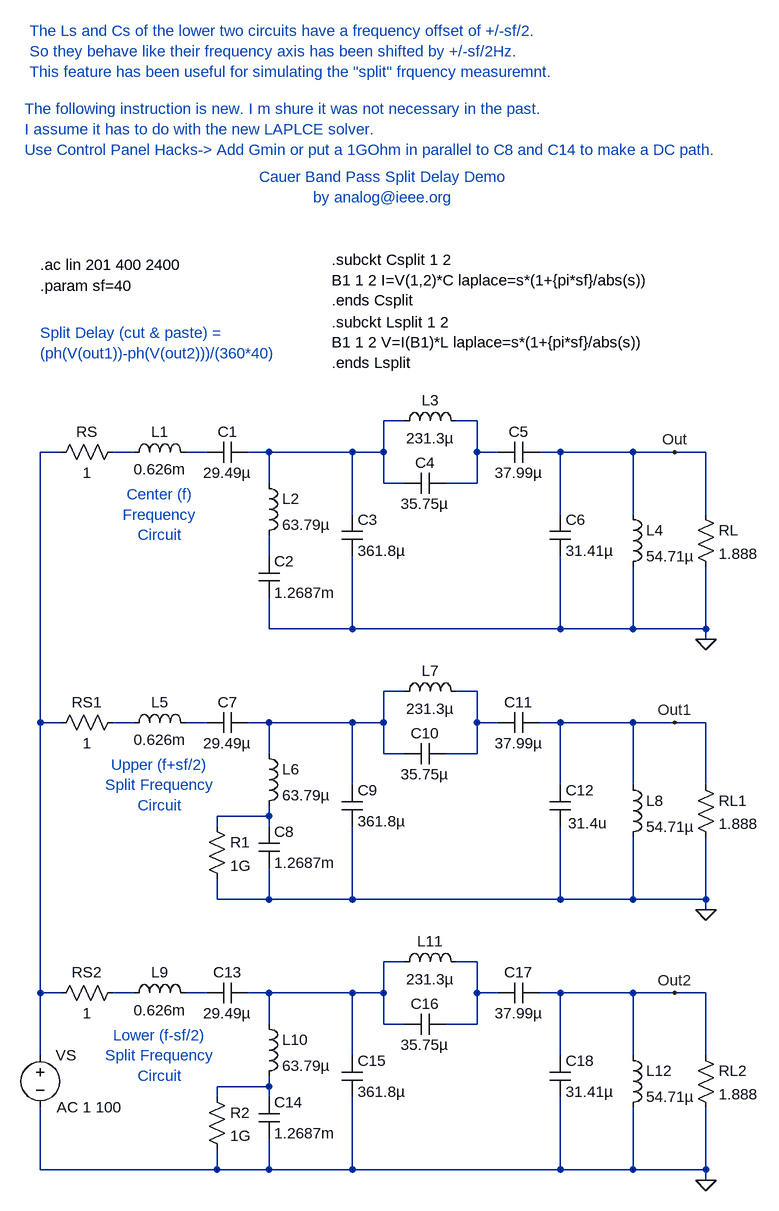
[diagram p0: schematic split_freq_filter.asc]
split_freq_filter.asc, the LTspice schematic file:
Version 4
SHEET 1 1868 1332
WIRE 80 128 48 128
WIRE 48 128 48 544
WIRE 160 128 192 128
WIRE 272 128 304 128
WIRE 400 128 400 176
WIRE 528 128 528 224
WIRE 576 176 608 176
WIRE 576 176 576 128
WIRE 576 80 608 80
WIRE 672 176 720 176
WIRE 720 176 720 128
WIRE 720 80 688 80
WIRE 528 288 528 400
WIRE 400 352 400 400
WIRE 400 256 400 288
WIRE 368 128 400 128
WIRE 400 128 528 128
WIRE 576 128 576 80
WIRE 720 128 752 128
WIRE 720 128 720 80
WIRE 816 128 848 128
WIRE 848 128 960 128
WIRE 848 224 848 128
WIRE 1072 128 1072 224
WIRE 960 224 960 128
WIRE 848 288 848 400
WIRE 1072 400 1072 304
WIRE 960 304 960 400
WIRE 848 400 528 400
WIRE 1072 416 1072 400
WIRE 528 128 576 128
WIRE 528 400 400 400
WIRE 960 128 1024 128
WIRE 960 400 848 400
WIRE 960 400 1072 400
WIRE 1024 128 1072 128
WIRE 80 544 48 544
WIRE 160 544 192 544
WIRE 272 544 304 544
WIRE 400 544 400 592
WIRE 528 544 528 640
WIRE 576 592 608 592
WIRE 576 592 576 544
WIRE 576 496 608 496
WIRE 672 592 720 592
WIRE 720 592 720 544
WIRE 720 496 688 496
WIRE 528 704 528 816
WIRE 400 768 400 816
WIRE 400 672 400 688
WIRE 368 544 400 544
WIRE 400 544 528 544
WIRE 576 544 576 496
WIRE 720 544 752 544
WIRE 720 544 720 496
WIRE 816 544 848 544
WIRE 848 544 960 544
WIRE 848 640 848 544
WIRE 1072 544 1072 640
WIRE 960 640 960 544
WIRE 848 704 848 816
WIRE 1072 816 1072 720
WIRE 960 720 960 816
WIRE 848 816 528 816
WIRE 528 544 576 544
WIRE 528 816 400 816
WIRE 960 544 1024 544
WIRE 960 816 848 816
WIRE 960 816 1072 816
WIRE 1024 544 1072 544
WIRE 1072 832 1072 816
WIRE 80 960 48 960
WIRE 160 960 192 960
WIRE 272 960 304 960
WIRE 400 960 400 1008
WIRE 528 960 528 1056
WIRE 576 1008 608 1008
WIRE 576 1008 576 960
WIRE 576 912 608 912
WIRE 672 1008 720 1008
WIRE 720 1008 720 960
WIRE 720 912 688 912
WIRE 528 1120 528 1232
WIRE 400 1184 400 1232
WIRE 400 1088 400 1104
WIRE 368 960 400 960
WIRE 400 960 528 960
WIRE 576 960 576 912
WIRE 720 960 752 960
WIRE 720 960 720 912
WIRE 816 960 848 960
WIRE 848 960 960 960
WIRE 848 1056 848 960
WIRE 1072 960 1072 1056
WIRE 960 1056 960 960
WIRE 848 1120 848 1232
WIRE 1072 1232 1072 1136
WIRE 960 1136 960 1232
WIRE 848 1232 528 1232
WIRE 528 960 576 960
WIRE 528 1232 400 1232
WIRE 960 960 1024 960
WIRE 960 1232 848 1232
WIRE 960 1232 1072 1232
WIRE 1024 960 1072 960
WIRE 1072 1248 1072 1232
WIRE 48 960 48 544
WIRE 48 960 48 1056
WIRE 48 1136 48 1232
WIRE 48 1232 320 1232
WIRE 400 1104 320 1104
WIRE 400 1104 400 1120
WIRE 320 1104 320 1120
WIRE 320 1200 320 1232
WIRE 320 1232 400 1232
WIRE 320 704 320 688
WIRE 320 784 320 816
WIRE 320 816 400 816
WIRE 320 688 400 688
WIRE 400 688 400 704
FLAG 1024 128 Out
FLAG 1072 416 0
FLAG 1024 544 Out1
FLAG 1072 832 0
FLAG 1024 960 Out2
FLAG 1072 1248 0
SYMBOL voltage 48 1040 R0
WINDOW 123 25 96 Left 0
WINDOW 39 -32 56 VBottom 0
SYMATTR Value2 AC 1 100
SYMATTR InstName VS
SYMATTR Value ""
SYMBOL res 64 144 R270
WINDOW 0 32 56 VTop 0
WINDOW 3 0 56 VBottom 0
SYMATTR InstName RS
SYMATTR Value 1
SYMBOL ind 176 144 R270
WINDOW 0 32 56 VTop 0
WINDOW 3 5 56 VBottom 0
SYMATTR InstName L1
SYMATTR Value 0.626m
SYMATTR SpiceLine Rser=0
SYMBOL cap 304 144 R270
WINDOW 0 32 32 VTop 0
WINDOW 3 0 32 VBottom 0
SYMATTR InstName C1
SYMATTR Value 29.49µ
SYMBOL ind 384 160 R0
SYMATTR InstName L2
SYMATTR Value 63.79µ
SYMATTR SpiceLine Rser=0
SYMBOL cap 384 288 R0
SYMATTR InstName C2
SYMATTR Value 1.2687m
SYMBOL cap 512 224 R0
SYMATTR InstName C3
SYMATTR Value 361.8µ
SYMBOL cap 608 192 R270
WINDOW 0 32 32 VTop 0
WINDOW 3 0 32 VBottom 0
SYMATTR InstName C4
SYMATTR Value 35.75µ
SYMBOL ind 592 96 R270
WINDOW 0 32 56 VTop 0
WINDOW 3 5 56 VBottom 0
SYMATTR InstName L3
SYMATTR Value 231.3µ
SYMATTR SpiceLine Rser=0
SYMBOL cap 752 144 R270
WINDOW 0 32 32 VTop 0
WINDOW 3 0 32 VBottom 0
SYMATTR InstName C5
SYMATTR Value 37.99µ
SYMBOL cap 832 224 R0
SYMATTR InstName C6
SYMATTR Value 31.41µ
SYMBOL ind 944 208 R0
SYMATTR InstName L4
SYMATTR Value 54.71µ
SYMATTR SpiceLine Rser=0
SYMBOL res 1056 208 R0
SYMATTR InstName RL
SYMATTR Value 1.888
SYMBOL res 64 560 R270
WINDOW 0 32 56 VTop 0
WINDOW 3 0 56 VBottom 0
SYMATTR InstName RS1
SYMATTR Value 1
SYMBOL ind 176 560 R270
WINDOW 0 32 56 VTop 0
WINDOW 3 5 56 VBottom 0
SYMATTR InstName L5
SYMATTR Value 0.626m
SYMATTR Prefix X
SYMATTR SpiceModel Lsplit L=
SYMBOL cap 304 560 R270
WINDOW 0 32 32 VTop 0
WINDOW 3 0 32 VBottom 0
SYMATTR InstName C7
SYMATTR Value 29.49µ
SYMATTR Prefix X
SYMATTR SpiceModel Csplit C=
SYMBOL ind 384 576 R0
SYMATTR InstName L6
SYMATTR Value 63.79µ
SYMATTR Prefix X
SYMATTR SpiceModel Lsplit L=
SYMBOL cap 384 704 R0
SYMATTR InstName C8
SYMATTR Value 1.2687m
SYMATTR Prefix X
SYMATTR SpiceModel Csplit C=
SYMBOL cap 512 640 R0
SYMATTR InstName C9
SYMATTR Value 361.8µ
SYMATTR Prefix X
SYMATTR SpiceModel Csplit C=
SYMBOL cap 608 608 R270
WINDOW 0 32 32 VTop 0
WINDOW 3 0 32 VBottom 0
SYMATTR InstName C10
SYMATTR Value 35.75µ
SYMATTR Prefix X
SYMATTR SpiceModel Csplit C=
SYMBOL ind 592 512 R270
WINDOW 0 32 56 VTop 0
WINDOW 3 5 56 VBottom 0
SYMATTR InstName L7
SYMATTR Value 231.3µ
SYMATTR Prefix X
SYMATTR SpiceModel Lsplit L=
SYMBOL cap 752 560 R270
WINDOW 0 32 32 VTop 0
WINDOW 3 0 32 VBottom 0
SYMATTR InstName C11
SYMATTR Value 37.99µ
SYMATTR Prefix X
SYMATTR SpiceModel Csplit C=
SYMBOL cap 832 640 R0
WINDOW 3 28 59 Left 0
SYMATTR Value 31.4u
SYMATTR InstName C12
SYMATTR Prefix X
SYMATTR SpiceModel Csplit C=
SYMBOL ind 944 624 R0
SYMATTR InstName L8
SYMATTR Value 54.71µ
SYMATTR Prefix X
SYMATTR SpiceModel Lsplit L=
SYMBOL res 1056 624 R0
SYMATTR InstName RL1
SYMATTR Value 1.888
SYMBOL res 64 976 R270
WINDOW 0 32 56 VTop 0
WINDOW 3 0 56 VBottom 0
SYMATTR InstName RS2
SYMATTR Value 1
SYMBOL ind 176 976 R270
WINDOW 0 32 56 VTop 0
WINDOW 3 5 56 VBottom 0
SYMATTR InstName L9
SYMATTR Value 0.626m
SYMATTR Prefix X
SYMATTR SpiceModel Lsplit L=
SYMATTR Value2 sf={-sf}
SYMBOL cap 304 976 R270
WINDOW 0 32 32 VTop 0
WINDOW 3 0 32 VBottom 0
SYMATTR InstName C13
SYMATTR Value 29.49µ
SYMATTR Prefix X
SYMATTR SpiceModel Csplit C=
SYMATTR Value2 sf={-sf}
SYMBOL ind 384 992 R0
SYMATTR InstName L10
SYMATTR Value 63.79µ
SYMATTR Prefix X
SYMATTR SpiceModel Lsplit L=
SYMATTR Value2 sf={-sf}
SYMBOL cap 384 1120 R0
SYMATTR InstName C14
SYMATTR Value 1.2687m
SYMATTR Prefix X
SYMATTR SpiceModel Csplit C=
SYMATTR Value2 sf={-sf}
SYMBOL cap 512 1056 R0
SYMATTR InstName C15
SYMATTR Value 361.8µ
SYMATTR Prefix X
SYMATTR SpiceModel Csplit C=
SYMATTR Value2 sf={-sf}
SYMBOL cap 608 1024 R270
WINDOW 0 32 32 VTop 0
WINDOW 3 0 32 VBottom 0
SYMATTR InstName C16
SYMATTR Value 35.75µ
SYMATTR Prefix X
SYMATTR SpiceModel Csplit C=
SYMATTR Value2 sf={-sf}
SYMBOL ind 592 928 R270
WINDOW 0 32 56 VTop 0
WINDOW 3 5 56 VBottom 0
SYMATTR InstName L11
SYMATTR Value 231.3µ
SYMATTR Prefix X
SYMATTR SpiceModel Lsplit L=
SYMATTR Value2 sf={-sf}
SYMBOL cap 752 976 R270
WINDOW 0 32 32 VTop 0
WINDOW 3 0 32 VBottom 0
SYMATTR InstName C17
SYMATTR Value 37.99µ
SYMATTR Prefix X
SYMATTR SpiceModel Csplit C=
SYMATTR Value2 sf={-sf}
SYMBOL cap 832 1056 R0
SYMATTR InstName C18
SYMATTR Value 31.41µ
SYMATTR Prefix X
SYMATTR SpiceModel Csplit C=
SYMATTR Value2 sf={-sf}
SYMBOL ind 944 1040 R0
SYMATTR InstName L12
SYMATTR Value 54.71µ
SYMATTR Prefix X
SYMATTR SpiceModel Lsplit L=
SYMATTR Value2 sf={-sf}
SYMBOL res 1056 1040 R0
SYMATTR InstName RL2
SYMATTR Value 1.888
SYMBOL res 304 688 R0
SYMATTR InstName R1
SYMATTR Value 1G
SYMBOL res 304 1104 R0
SYMATTR InstName R2
SYMATTR Value 1G
TEXT 48 -160 Left 0 !.ac lin 201 400 2400
TEXT 576 -280 Center 0 ;Cauer Band Pass Split Delay Demo\nby analog@ieee.org
TEXT 496 -168 Left 0 !.subckt Csplit 1 2\nB1 1 2 I=V(1,2)*C laplace=s*(1+{pi*sf}/abs(s))\n.ends Csplit
TEXT 48 -56 Left 0 ;Split Delay (cut & paste) =
TEXT 496 -72 Left 0 !.subckt Lsplit 1 2\nB1 1 2 V=I(B1)*L laplace=s*(1+{pi*sf}/abs(s))\n.ends Lsplit
TEXT 48 -128 Left 0 !.param sf=40
TEXT 232 640 Center 0 ;Upper (f+sf/2)\nSplit Frequency\nCircuit
TEXT 232 1056 Center 0 ;Lower (f-sf/2)\nSplit Frequency\nCircuit
TEXT 48 -24 Left 0 ;(ph(V(out1))-ph(V(out2)))/(360*40)
TEXT 232 224 Center 0 ;Center (f)\nFrequency\nCircuit
TEXT 24 -400 Left 0 ;The following instruction is new. I m shure it was not necessary in the past.\nI assume it has to do with the new LAPLCE solver.\nUse Control Panel Hacks-> Add Gmin or put a 1GOhm in parallel to C8 and C14 to make a DC path.
TEXT 32 -520 Left 0 ;The Ls and Cs of the lower two circuits have a frequency offset of +/-sf/2.\nSo they behave like their frequency axis has been shifted by +/-sf/2Hz.\nThis feature has been useful for simulating the "split" frquency measuremnt.

The netlist it stands for:
* split_freq_filter.asc
VS N001 0 AC 1 100
RS N001 N002 1
L1 N002 N003 0.626m Rser=0
C1 N003 N004 29.49µ
L2 N004 N006 63.79µ Rser=0
C2 N006 0 1.2687m
C3 N004 0 361.8µ
C4 N004 N005 35.75µ
L3 N004 N005 231.3µ Rser=0
C5 N005 Out 37.99µ
C6 Out 0 31.41µ
L4 Out 0 54.71µ Rser=0
RL Out 0 1.888
RS1 N001 N007 1
XL5 N007 N008 Lsplit L= 0.626m  ; pins A B
XC7 N008 N009 Csplit C= 29.49µ  ; pins A B
XL6 N009 N011 Lsplit L= 63.79µ  ; pins A B
XC8 N011 0 Csplit C= 1.2687m  ; pins A B
XC9 N009 0 Csplit C= 361.8µ  ; pins A B
XC10 N009 N010 Csplit C= 35.75µ  ; pins A B
XL7 N009 N010 Lsplit L= 231.3µ  ; pins A B
XC11 N010 Out1 Csplit C= 37.99µ  ; pins A B
XC12 Out1 0 Csplit C= 31.4u  ; pins A B
XL8 Out1 0 Lsplit L= 54.71µ  ; pins A B
RL1 Out1 0 1.888
RS2 N001 N012 1
XL9 N012 N013 Lsplit L= 0.626m sf={-sf}  ; pins A B
XC13 N013 N014 Csplit C= 29.49µ sf={-sf}  ; pins A B
XL10 N014 N016 Lsplit L= 63.79µ sf={-sf}  ; pins A B
XC14 N016 0 Csplit C= 1.2687m sf={-sf}  ; pins A B
XC15 N014 0 Csplit C= 361.8µ sf={-sf}  ; pins A B
XC16 N014 N015 Csplit C= 35.75µ sf={-sf}  ; pins A B
XL11 N014 N015 Lsplit L= 231.3µ sf={-sf}  ; pins A B
XC17 N015 Out2 Csplit C= 37.99µ sf={-sf}  ; pins A B
XC18 Out2 0 Csplit C= 31.41µ sf={-sf}  ; pins A B
XL12 Out2 0 Lsplit L= 54.71µ sf={-sf}  ; pins A B
RL2 Out2 0 1.888
R1 N011 0 1G
R2 N016 0 1G
.ac lin 201 400 2400
* Cauer Band Pass Split Delay Demo
* by analog@ieee.org
.subckt Csplit 1 2
B1 1 2 I=V(1,2)*C laplace=s*(1+{pi*sf}/abs(s))
.ends Csplit
* Split Delay (cut & paste) =
.subckt Lsplit 1 2
B1 1 2 V=I(B1)*L laplace=s*(1+{pi*sf}/abs(s))
.ends Lsplit
.param sf=40
* Upper (f+sf/2)
* Split Frequency
* Circuit
* Lower (f-sf/2)
* Split Frequency
* Circuit
* (ph(V(out1))-ph(V(out2)))/(360*40)
* Center (f)
* Frequency
* Circuit
* The following instruction is new. I m shure it was not necessary in the past.
* I assume it has to do with the new LAPLCE solver.
* Use Control Panel Hacks-> Add Gmin or put a 1GOhm in parallel to C8 and C14 to make a DC path.
* The Ls and Cs of the lower two circuits have a frequency offset of +/-sf/2.
* So they behave like their frequency axis has been shifted by +/-sf/2Hz.
* This feature has been useful for simulating the "split" frquency measuremnt.
.backanno
.end